# Altium schematic sheet ESP32+ADC+DAC.SchDoc
size 431 x 279 mm; SheetNumber: 2; SheetTotal: 6; ENG_APP_DATE: --/--/--; DSN_APP_DATE: --/--/--; CHK_APP_DATE: --/--/--
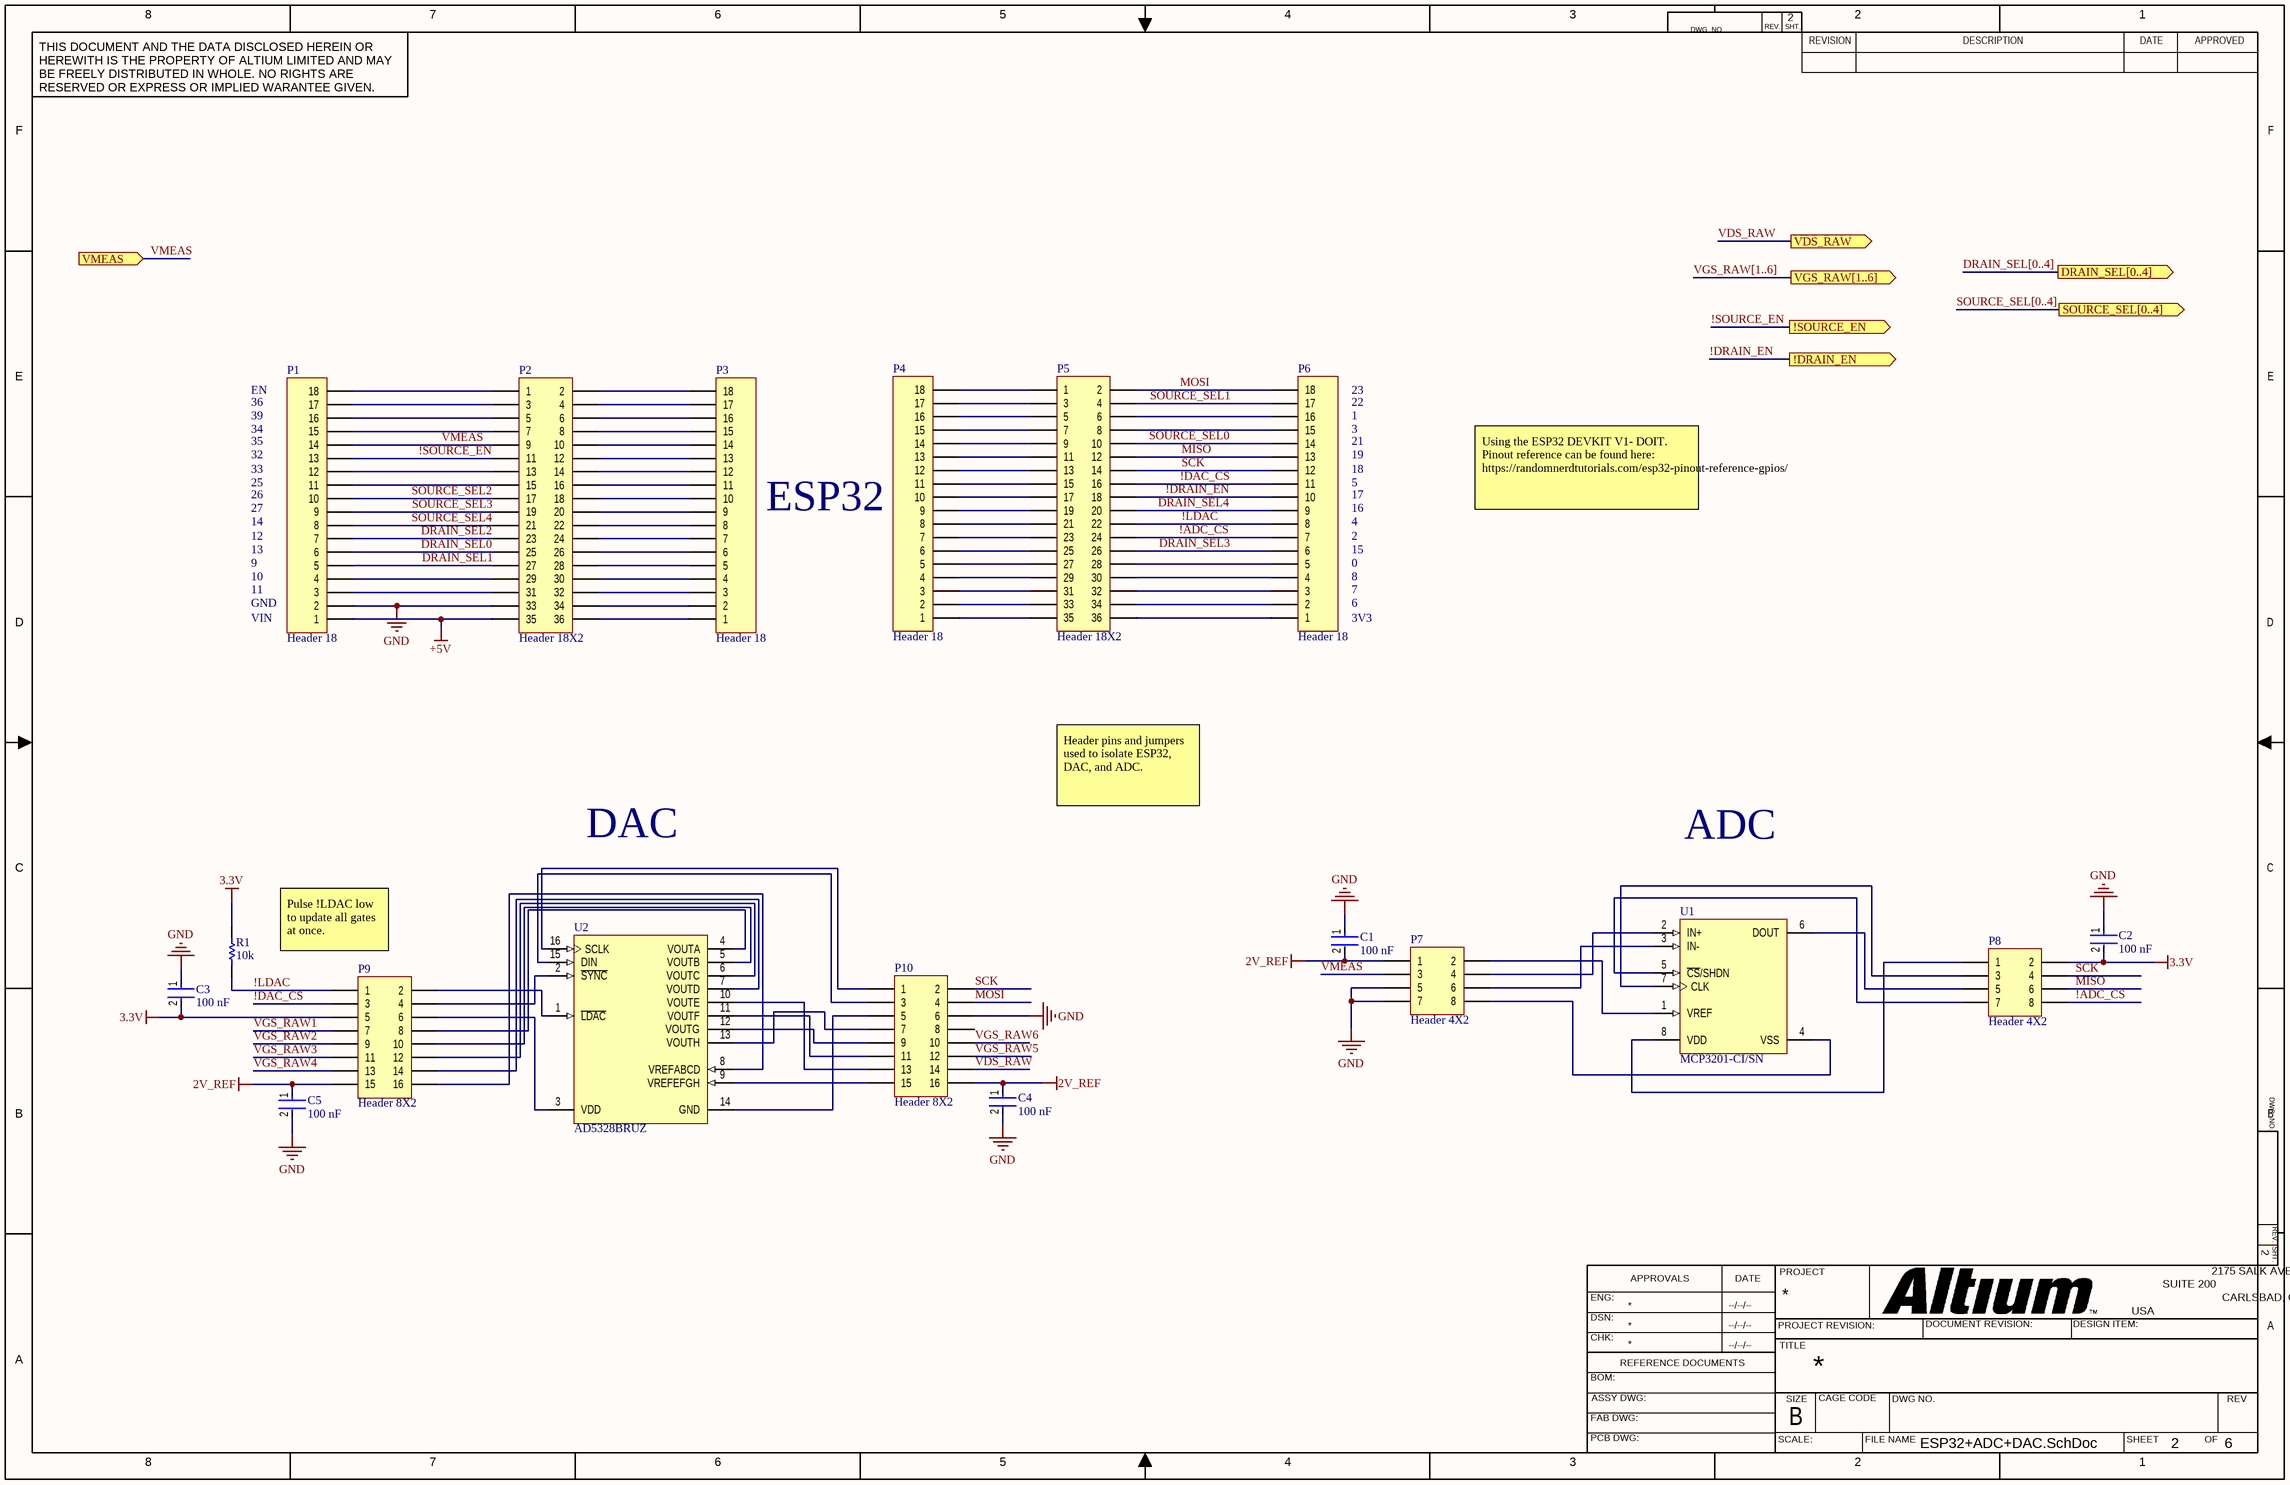
[diagram p0: ESP32+ADC+DAC.SchDoc]

## Parts
C1  100 nF  [FP-C0805C-DN-MFG]
C2  100 nF  [FP-C0805C-DN-MFG]
C3  100 nF  [FP-C0805C-DN-MFG]
C4  100 nF  [FP-C0805C-DN-MFG]
C5  100 nF  [FP-C0805C-DN-MFG]
P1  Header 18  [HDR1X18]
P2  Header 18X2  [HDR2X18]
P3  Header 18  [HDR1X18]
P4  Header 18  [HDR1X18]
P5  Header 18X2  [HDR2X18]
P6  Header 18  [HDR1X18]
P7  Header 4X2  [HDR2X4]
P8  Header 4X2  [HDR2X4]
P9  Header 8X2  [HDR2X8]
P10  Header 8X2  [HDR2X8]
R1  10k  [RESC2013X60X35NL10T20]
U1  MCP3201-CI/SN  [SOIC-SN8_L]
U2  AD5328BRUZ  [RU-16_L]

## Ports
!DRAIN_EN (out), !SOURCE_EN (out), DRAIN_SEL[0..4] (out), SOURCE_SEL[0..4] (out), VDS_RAW (out), VGS_RAW[1..6] (out), VMEAS (in)

## Nets
2V_REF: C1.2 C4.1 C5.1 P7.1 P9.15 P10.16
3.3V: C2.2 C3.2 P8.2 P9.5 R1.2
+5V: P1.1 P2.35
GND: C1.1 C2.1 C3.1 C4.2 C5.2 P1.2 P2.33 P7.5 P7.7 P10.6
!ADC_CS: P5.24 P6.7 P8.8
!DAC_CS: P5.16 P6.11 P9.3
!DRAIN_EN: P5.18 P6.10 ; port !DRAIN_EN
!LDAC: P5.22 P6.8 P9.1 R1.1
!SOURCE_EN: P1.13 P2.11 ; port !SOURCE_EN
DRAIN_SEL0: P1.6 P2.25
DRAIN_SEL1: P1.5 P2.27
DRAIN_SEL2: P1.7 P2.23
DRAIN_SEL3: P5.26 P6.6
DRAIN_SEL4: P5.20 P6.9
MISO: P5.12 P6.13 P8.6
MOSI: P5.2 P6.18 P10.4
SCK: P5.14 P6.12 P8.4 P10.2
SOURCE_SEL0: P5.10 P6.14
SOURCE_SEL1: P5.4 P6.17
SOURCE_SEL2: P1.10 P2.17
SOURCE_SEL3: P1.9 P2.19
SOURCE_SEL4: P1.8 P2.21
VDS_RAW: P10.14 ; port VDS_RAW
VGS_RAW1: P9.7
VGS_RAW2: P9.9
VGS_RAW3: P9.11
VGS_RAW4: P9.13
VGS_RAW5: P10.12
VGS_RAW6: P10.10
VMEAS: P1.14 P2.9 P7.3 ; port VMEAS
NetP1_3: P1.3 P2.31
NetP1_4: P1.4 P2.29
NetP1_11: P1.11 P2.15
NetP1_12: P1.12 P2.13
NetP1_15: P1.15 P2.7
NetP1_16: P1.16 P2.5
NetP1_17: P1.17 P2.3
NetP1_18: P1.18 P2.1
NetP2_2: P2.2 P3.18
NetP2_4: P2.4 P3.17
NetP2_6: P2.6 P3.16
NetP2_8: P2.8 P3.15
NetP2_10: P2.10 P3.14
NetP2_12: P2.12 P3.13
NetP2_14: P2.14 P3.12
NetP2_16: P2.16 P3.11
NetP2_18: P2.18 P3.10
NetP2_20: P2.20 P3.9
NetP2_22: P2.22 P3.8
NetP2_24: P2.24 P3.7
NetP2_26: P2.26 P3.6
NetP2_28: P2.28 P3.5
NetP2_30: P2.30 P3.4
NetP2_32: P2.32 P3.3
NetP2_34: P2.34 P3.2
NetP2_36: P2.36 P3.1
NetP4_1: P4.1 P5.35
NetP4_2: P4.2 P5.33
NetP4_3: P4.3 P5.31
NetP4_4: P4.4 P5.29
NetP4_5: P4.5 P5.27
NetP4_6: P4.6 P5.25
NetP4_7: P4.7 P5.23
NetP4_8: P4.8 P5.21
NetP4_9: P4.9 P5.19
NetP4_10: P4.10 P5.17
NetP4_11: P4.11 P5.15
NetP4_12: P4.12 P5.13
NetP4_13: P4.13 P5.11
NetP4_14: P4.14 P5.9
NetP4_15: P4.15 P5.7
NetP4_16: P4.16 P5.5
NetP4_17: P4.17 P5.3
NetP4_18: P4.18 P5.1
NetP5_6: P5.6 P6.16
NetP5_8: P5.8 P6.15
NetP5_28: P5.28 P6.5
NetP5_30: P5.30 P6.4
NetP5_32: P5.32 P6.3
NetP5_34: P5.34 P6.2
NetP5_36: P5.36 P6.1
NetP7_2: P7.2 U1.1(VREF)
NetP7_4: P7.4 U1.2(IN+)
NetP7_6: P7.6 U1.3(IN-)
NetP7_8: P7.8 U1.4(VSS)
NetP8_1: P8.1 U1.8(VDD)
NetP8_3: P8.3 U1.7(CLK)
NetP8_5: P8.5 U1.6(DOUT)
NetP8_7: P8.7 U1.5(~{CS}/SHDN)
NetP9_2: P9.2 U2.1(~{LDAC})
NetP9_4: P9.4 U2.2(~{SYNC})
NetP9_6: P9.6 U2.3(VDD)
NetP9_8: P9.8 U2.4(VOUTA)
NetP9_10: P9.10 U2.5(VOUTB)
NetP9_12: P9.12 U2.6(VOUTC)
NetP9_14: P9.14 U2.7(VOUTD)
NetP9_16: P9.16 U2.8(VREFABCD)
NetP10_1: P10.1 U2.16(SCLK)
NetP10_3: P10.3 U2.15(DIN)
NetP10_5: P10.5 U2.14(GND)
NetP10_7: P10.7 U2.13(VOUTH)
NetP10_9: P10.9 U2.12(VOUTG)
NetP10_11: P10.11 U2.11(VOUTF)
NetP10_13: P10.13 U2.10(VOUTE)
NetP10_15: P10.15 U2.9(VREFEFGH)

Not connected (* = marked no-connect by the designer): P10 8

## Buses and harness runs
bus DRAIN_SEL[0..4] = port DRAIN_SEL[0..4]
bus SOURCE_SEL[0..4] = port SOURCE_SEL[0..4]
bus VGS_RAW[1..6] = port VGS_RAW[1..6]

## Notes on the sheet
- EN
- 36
- 39
- 34
- 23
- 22
- 1
- 3
- 35
- 32
- 33
- 25
- 26
- 21
- 19
- 18
- 5
- 17
- 27
- 14
- 12
- 13
- 9
- ESP32
- 16
- 4
- 2
- 15
- 0
- Using the ESP32 DEVKIT V1- DOIT. Pinout reference can be found here: https://randomnerdtutorials.com/esp32-pinout-reference-gpios/
- 10
- 11
- GND
- VIN
- 8
- 7
- 6
- 3V3
- Header pins and jumpers used to isolate ESP32, DAC, and ADC.
- DAC
- ADC
- Pulse !LDAC low to update all gates at once.
- DWG. NO.
- REV.
- SHT.
- THIS DOCUMENT AND THE DATA DISCLOSED HEREIN OR HEREWITH IS THE PROPERTY OF ALTIUM LIMITED AND MAY BE FREELY DISTRIBUTED IN WHOLE. NO RIGHTS ARE RESERVED OR EXPRESS OR IMPLIED WARANTEE GIVEN.
- REVISION
- DESCRIPTION
- DATE
- APPROVED
- F
- E
- D
- C
- B
- ENG:
- APPROVALS
- PROJECT
- SUITE 200
- 2175 SALK AVENUE
- CARLSBAD, CA 92008
- A
- DSN:
- CHK:
- REFERENCE DOCUMENTS
- PROJECT REVISION:
- TITLE
- DOCUMENT REVISION:
- DESIGN ITEM:
- USA
- BOM:
- FAB DWG:
- PCB DWG:
- ASSY DWG:
- SCALE:
- SIZE
- CAGE CODE
- FILE NAME
- DWG NO.
- SHEET
- OF
- REV

## Library data of the parts
C1-C5 = CMP-2007-00279-2: CAP CER 0.1UF 50V X7R 0805; Manufacturer Part Number: C0805C104K5RACTU; Manufacturer: KEMET; Value: 0.10 μF; Tolerance: 0.1; Temperature Coefficient: 30ppm/°C; Material: Ceramic; Device Class L2: Capacitors; Temperature Range Low: -55°C; Voltage Rating: 50 V; Digikey Description: CAP CER 0.1UF 50V X7R 0805; Category: Cap; ComponentLink2Description: Datasheet; Octopart: https://octopart.com/c0805c104k5ractu-kemet-143926; RoHS: TRUE; ComponentLink2URL: https://content.kemet.com/datasheets/KEM_C1003_C0G_SMD.pdf; Temperature Characteristic: X7R; Temperature: -55°C to +125°C; Height: 0.88mm; Temperature Range High: +125°C; Device Class L1: Passive Components; Automotive: No; Lead Free: Yes; Ipc Land Pattern Name: CAPC200125X78; Device Class L3: Ceramic Capacitors; Mouser Description: Cap Ceramic 0.1uF 50V X7R 10% SMD 2.0 x 1.2 mm 125 C Paper T/R; Capacitance: 0.10 μF; Package: C0805C-DN
P1 P3 P4 P6 = Header 18: Header, 18-Pin; LatestRevisionDate: 17-Jul-2002; LatestRevisionNote: Re-released for DXP Platform.; Publisher: Altium Limited
P2 P5 = Header 18X2: Header, 18-Pin, Dual row; LatestRevisionDate: 17-Jul-2002; LatestRevisionNote: Re-released for DXP Platform.; Publisher: Altium Limited
P7 P8 = Header 4X2: Header, 4-Pin, Dual row; LatestRevisionDate: 17-Jul-2002; LatestRevisionNote: Re-released for DXP Platform.; Publisher: Altium Limited
P9 P10 = Header 8X2: Header, 8-Pin, Dual row; LatestRevisionDate: 17-Jul-2002; LatestRevisionNote: Re-released for DXP Platform.; Publisher: Altium Limited
R1 = CMP-1659-00013-4: Chip Resistor, 10 KOhm, +/- 1%, 0.125 W, -55 to 155 degC, 0805 (2012 Metric), RoHS, Tape and Reel; Manufacturer: Yageo; Voltage Rating: 150 V; Mount: Surface Mount; ComponentLink1Description: Manufacturer URL; ComponentLink2URL: http://www.yageo.com/documents/recent/PYu-RC_Group_51_RoHS_L_04.pdf; Pins: 2; Length: 2 mm; Min Operating Temperature: -55 degC; Height: 0.5 mm; Mounting Technology: Surface Mount; RoHSCompliant: true; REACH SVHC: No SVHC; ComponentLink1URL: http://www.yageo.com/; Max Operating Temperature: 155 degC; PackageReference: 0805; DatasheetVersion: Rev. 4, 02/2016; Package Quantity: 5000; Packaging: Tape and Reel; ComponentLink2Description: Datasheet; PackageDescription: 2-Pin Surface Mounted Device, Body 2 x 1.25 mm
U1 = CMP-0188-00469-2: 2.7V 12-Bit A/D Converter with SPI Serial Interface, 8-Pin SOIC 150mil, C Performance Grade, Industrial Temperature; ComponentLink1URL: http://www.microchip.com/; DatasheetVersion: revF, Aug-2011; RevisionNote: URLs added. DatasheetVersion updated.; Code_IPC: SOIC127P600-8; ComponentLink3URL: http://www.microchip.com/stellent/groups/techpub_sg/documents/packagingspec/en012702.pdf; ComponentLink3Description: Package Specification; ComponentLink2URL: http://ww1.microchip.com/downloads/en/DeviceDoc/21290F.pdf; PackageReference: SOIC-SN8; ComponentLink1Description: Manufacturer URL; ComponentLink2Description: Datasheet; PackageVersion: revBB, Aug-2009; Code_JEDEC: MS-012; PackageDescription: 8-Lead Plastic Small Outline (SN) - Narrow, 3.90mm Body [SOIC]
U2 = CMP-0318-02011-2: Octal 12-Bit Voltage Output Digital-to-Analog Converter, 2.5 to 5.5 V, -40 to +125 degC, RU-16, Pb-Free, Tube; Generic Part Number: AD5328; Manufacturer: Analog Devices; Settling Time: 6Âµs; Op Pwr Diss: 5mW; Max V+: 5.5V; Single Supply: Yes; Resolution (Bits): 12; # DAC Outputs: 8; PackageDescription: 16-Lead Thin Shrink Small Outline Package [TSSOP]; ComponentLink3URL: http://www.analog.com/static/imported-files/packages/36244347913743854010197452789RU16.pdf; DatasheetVersion: Rev.F; ComponentLink2Description: Datasheet; Mounting Technology: Surface Mount; ComponentLink4URL: http://www.analog.com/en/digital-to-analog-converters/da-converters/ad5328/products/product.html; RevisionNote: Component URL fixed; PackageVersion: Nov-2002; PackageReference: RU-16; ComponentLink1URL: http://www.analog.com/en/index.html; ComponentLink4Description: Product URL; ComponentLink1Description: Manufacturer URL; Packing: Tube; ComponentLink2URL: http://www.analog.com/static/imported-files/data_sheets/AD5308_5318_5328.pdf; RoHS: Y; ComponentLink3Description: Package Specification; Code_JEDEC: MO-153-AB; PartNumber: AD5328BRUZ